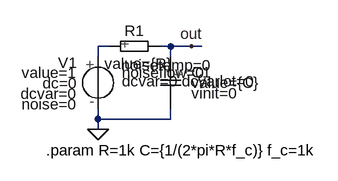
[diagram p0: schematic myFirstRCnetwork.asc]
myFirstRCnetwork.asc, the LTspice schematic file:
Version 4
SHEET 1 880 680
WIRE -48 208 -64 208
WIRE 48 208 32 208
WIRE 80 208 48 208
WIRE 96 208 80 208
WIRE -64 224 -64 208
WIRE 48 224 48 208
WIRE -64 320 -64 304
WIRE 48 320 48 304
WIRE 48 320 -64 320
WIRE -64 336 -64 320
FLAG -64 336 0
FLAG 80 208 out
SYMBOL SLV -64 224 M0
SYMATTR InstName V1
SYMATTR Value value=1
SYMBOL SLR -48 208 R270
WINDOW 0 8 40 VTop 2
WINDOW 3 -11 47 VBottom 2
WINDOW 123 -29 20 VRight 2
WINDOW 39 -41 21 VRight 2
WINDOW 40 -54 21 VRight 2
SYMATTR InstName R1
SYMATTR Value value={R}
SYMBOL SLC 48 224 R0
SYMATTR InstName C1
SYMATTR Value value={C}
TEXT -144 368 Left 2 !.param R=1k C={1/(2*pi*R*f_c)} f_c=1k

The netlist it stands for:
* myFirstRCnetwork.asc
V1 N001 0 V value=1 dc=0 dcvar=0 noise=0
R1 N001 out R value={R} noisetemp=0 noiseflow=0 dcvar=0 dcvarlot=0
C1 out 0 C value={C} vinit=0
.param R=1k C={1/(2*pi*R*f_c)} f_c=1k
.backanno
.end